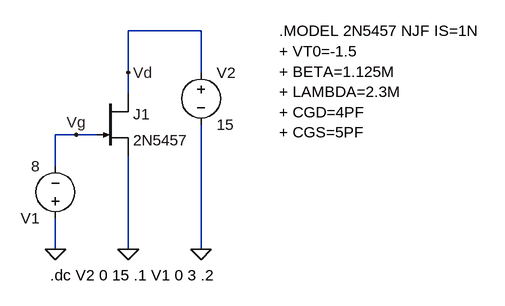
[diagram p0: schematic ej3.asc]
ej3.asc, the LTspice schematic file:
Version 4.1
SHEET 1 880 680
WIRE 320 0 208 0
WIRE 208 64 208 0
WIRE 320 64 320 0
WIRE 208 96 208 64
WIRE 128 160 96 160
WIRE 160 160 128 160
WIRE 96 208 96 160
WIRE 96 336 96 288
WIRE 208 336 208 192
WIRE 320 336 320 144
FLAG 208 336 0
FLAG 96 336 0
FLAG 320 336 0
FLAG 208 64 Vd
FLAG 128 160 Vg
SYMBOL njf 160 96 R0
SYMATTR InstName J1
SYMATTR Value 2N5457
SYMBOL voltage 96 304 R180
WINDOW 123 0 0 Left 0
WINDOW 39 0 0 Left 0
SYMATTR InstName V1
SYMATTR Value 8
SYMBOL voltage 320 48 R0
WINDOW 123 0 0 Left 0
WINDOW 39 0 0 Left 0
SYMATTR InstName V2
SYMATTR Value 15
TEXT 440 0 Left 2 !.MODEL 2N5457 NJF IS=1N \n+ VT0=-1.5\n+ BETA=1.125M\n+ LAMBDA=2.3M\n+ CGD=4PF\n+ CGS=5PF
TEXT 88 376 Left 2 !.dc V2 0 15 .1 V1 0 3 .2

The netlist it stands for:
* ej3.asc
J1 Vd Vg 0 2N5457
V1 0 Vg 8
V2 Vd 0 15
.model NJF NJF
.model PJF PJF
.lib standard.jft
.MODEL 2N5457 NJF IS=1N
+ VT0=-1.5
+ BETA=1.125M
+ LAMBDA=2.3M
+ CGD=4PF
+ CGS=5PF
.dc V2 0 15 .1 V1 0 3 .2
.backanno
.end